# Altium project Autoinformer_v1.1.PrjPcb (part 2 of 2)

## Sheet Sh3_Power.SchDoc
size A3
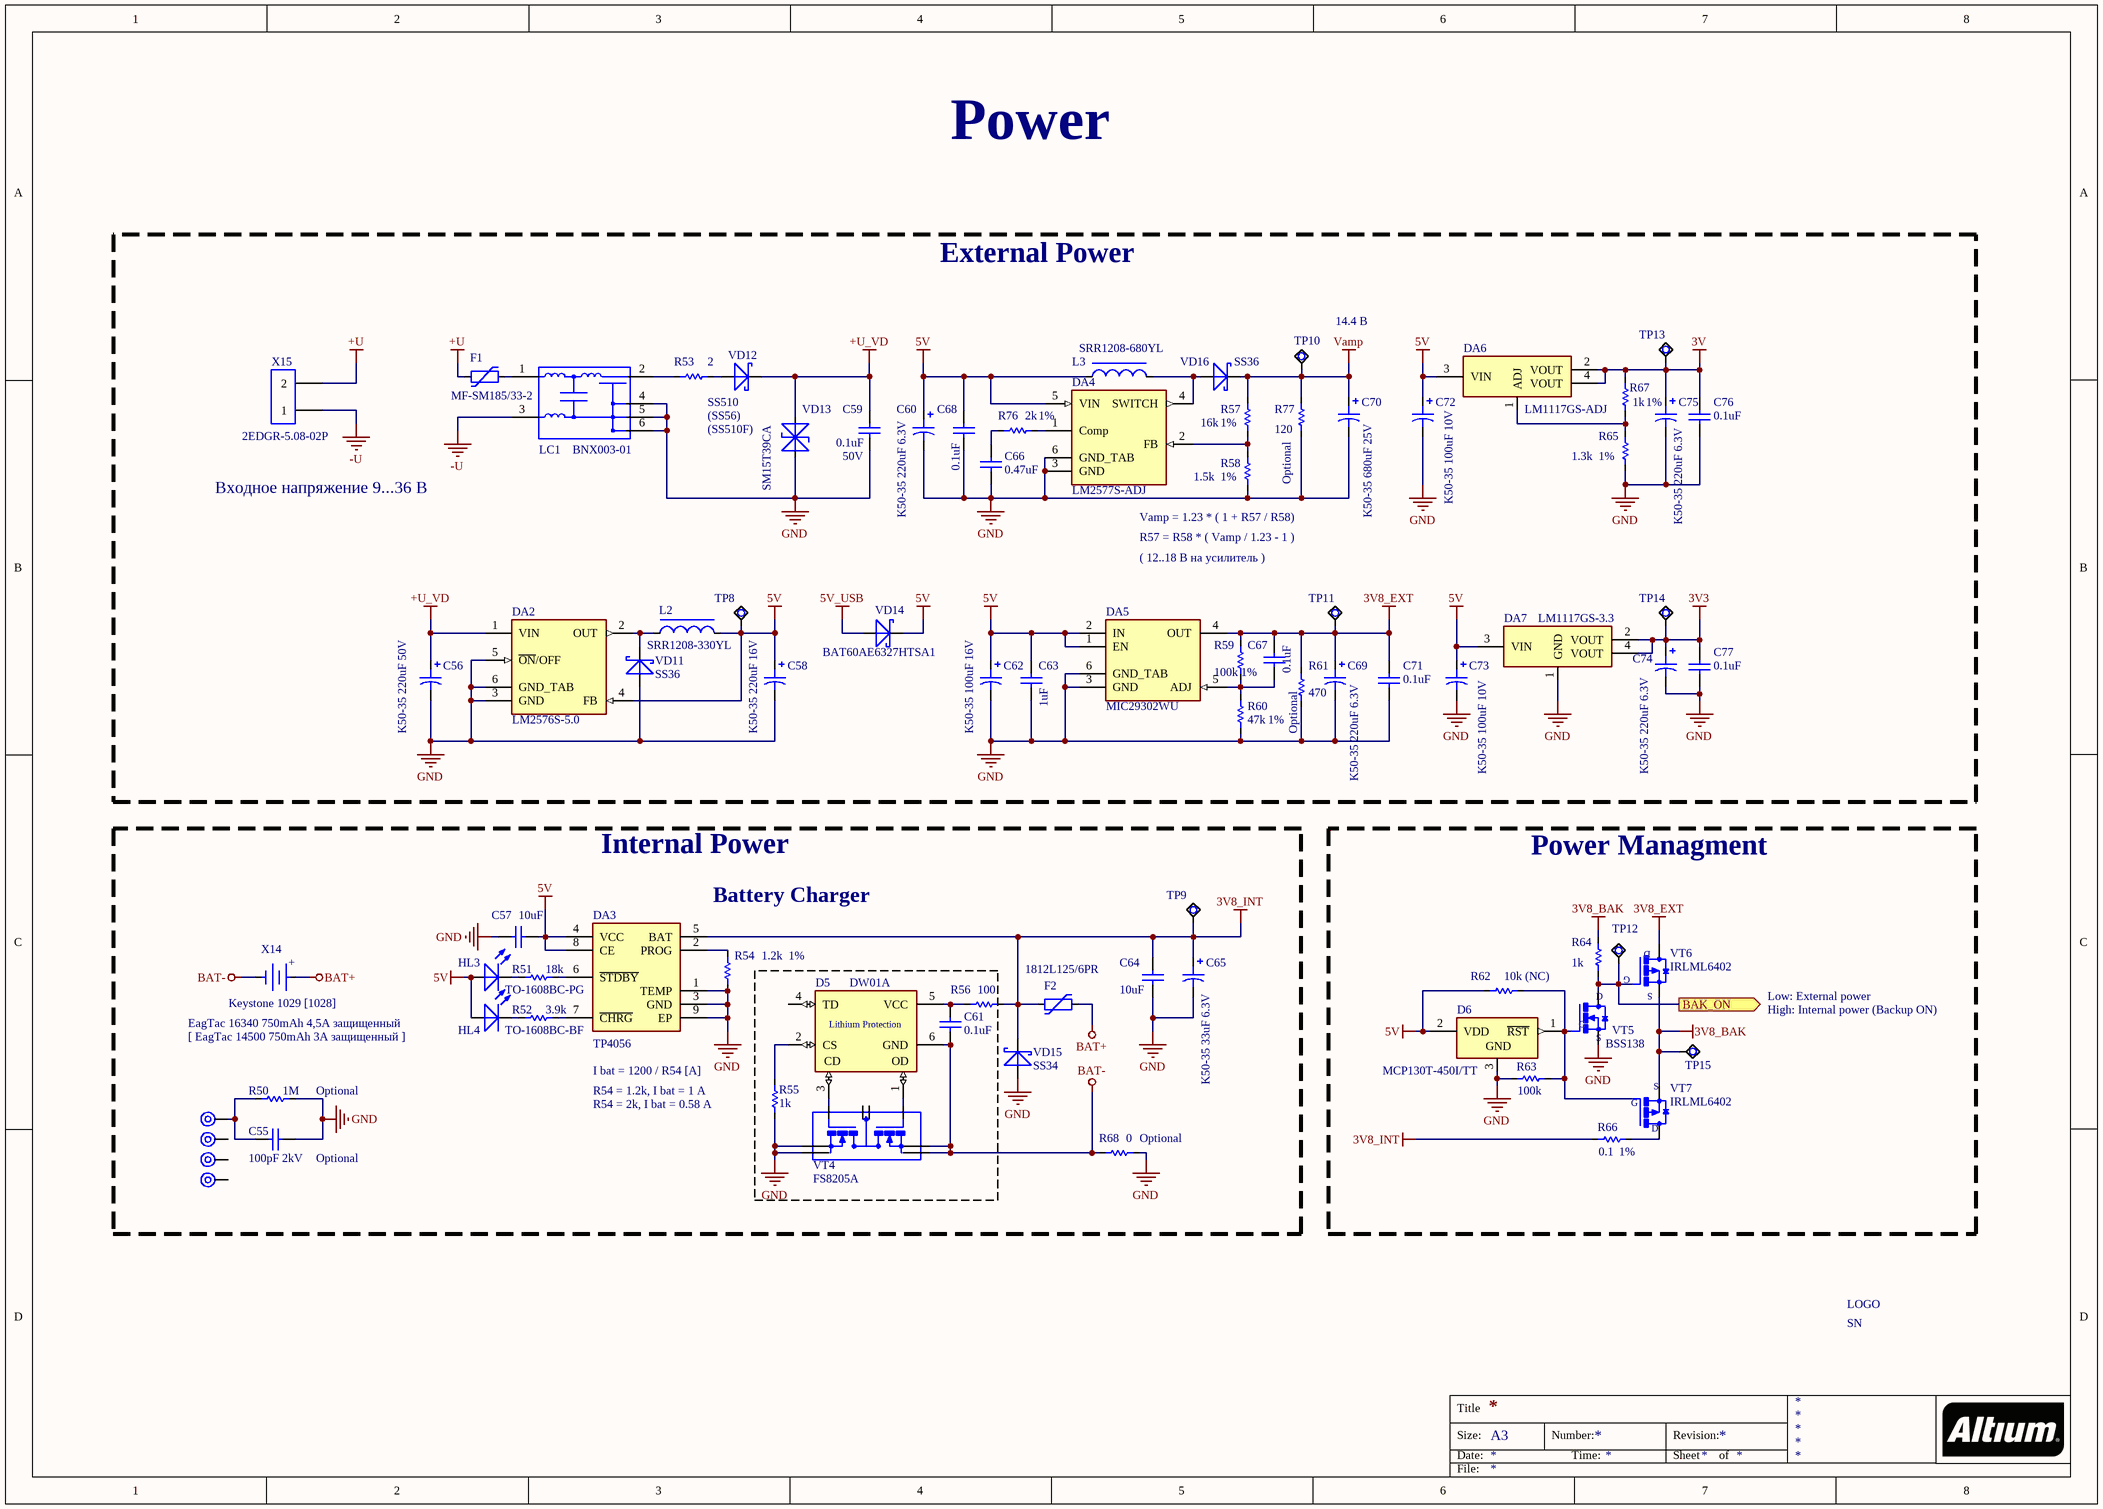
[diagram p3: Sh3_Power.SchDoc]

### Parts
BC1  Mounting Hole  [body_connection_1]  (value not drawn)
BC2  Mounting Hole  [body_connection_1]  (value not drawn)
BC3  Mounting Hole  [body_connection_1]  (value not drawn)
BC4  Mounting Hole  [body_connection_1]  (value not drawn)
C55  100pF 2kV  [C_SMD1206]
C56  K50-35 220uF 50V  [K50-35 10x12.5x5]
C57  10uF  [C_SMD0603]
C58  K50-35 220uF 16V  [K50-35 6.3x11x2.5]
C59  0.1uF  [C_SMD0603]
C60  K50-35 220uF 6.3V  [K50-35 6.3x11x2.5]
C61  0.1uF  [C_SMD0603]
C62  K50-35 100uF 16V  [K50-35 6.3x11x2.5]
C63  1uF  [C_SMD0603]
C64  10uF  [C_SMD0603]
C65  K50-35 33uF 6.3V  [K50-35mini 4x7x2]
C66  0.47uF  [C_SMD0603]
C67  0.1uF  [C_SMD0603]
C68  0.1uF  [C_SMD0603]
C69  K50-35 220uF 6.3V  [K50-35 6.3x11x2.5]
C70  K50-35 680uF 25V  [K50-35 10x12.5x5]
C71  0.1uF  [C_SMD0603]
C72  K50-35 100uF 10V  [K50-35 5x11x2]
C73  K50-35 100uF 10V  [K50-35 5x11x2]
C74  K50-35 220uF 6.3V  [K50-35 6.3x11x2.5]
C75  K50-35 220uF 6.3V  [K50-35 6.3x11x2.5]
C76  0.1uF  [C_SMD0603]
C77  0.1uF  [C_SMD0603]
D5  DW01A  [SOT23-6-D]
D6  MCP130T-450I/TT  [SOT23]
DA2  LM2576S-5.0  [TO263-5 - heatsink]
DA3  TP4056  [SOIC127P600X175-9N]
DA4  LM2577S-ADJ  [TO263-5 - heatsink]
DA5  MIC29302WU  [TO263-5 - heatsink]
DA6  LM1117GS-ADJ  [SOT223]
DA7  LM1117GS-3.3  [SOT223]
F1  MF-SM185/33-2  [FUSM8867X300N]
F2  1812L125/6PR  [FUSSC324X455X62L]
HL3  TO-1608BC-PG  [LED_SMD1608GREEN]
HL4  TO-1608BC-BF  [LED_SMD1608]
L2  SRR1208-330YL  [SRR1208]
L3  SRR1208-680YL  [SRR1208]
LC1  BNX003-01  [Murata_BNX_L12MM5_W11MM5_T13MM0_MFG]
N1  Logo  [LOGO_SS - bot]  (value not drawn)
N2  SN  [KZTA_SN]  (value not drawn)
R50  1M  [R_SMD1206]
R51  18k  [R_SMD0603]
R52  3.9k  [R_SMD0603]
R53  2  [R_SMD4527]
R54  1.2k  [R_SMD0603]
R55  1k  [R_SMD0603]
R56  100  [R_SMD0603]
R57  16k  [R_SMD0603]
R58  1.5k  [R_SMD0603]
R59  100k  [R_SMD0603]
R60  47k  [R_SMD0603]
R61  470  [R_SMD0805]
R62  10k (NC)  [R_SMD0603]
R63  100k  [R_SMD0603]
R64  1k  [R_SMD0603]
R65  1.3k  [R_SMD0603]
R66  0.1  [R_SMD0805]
R67  1k  [R_SMD0603]
R68  0  [R_SMD0805]
R76  2k  [R_SMD0603]
R77  120  [R_SMD0805]
TP8  Test_point  [TEST_POINT]  (value not drawn)
TP9  Test_point  [TEST_POINT]  (value not drawn)
TP10  Test_point  [TEST_POINT]  (value not drawn)
TP11  Test_point  [TEST_POINT]  (value not drawn)
TP12  Test_point  [TEST_POINT]  (value not drawn)
TP13  Test_point  [TEST_POINT]  (value not drawn)
TP14  Test_point  [TEST_POINT]  (value not drawn)
TP15  Test_point  [TEST_POINT]  (value not drawn)
VD11  SS36  [DO214AB SMC]
VD12  SS510  [SMC + SMAF]
VD13  SM15T39CA  [DO214AB SMC]
VD14  BAT60AE6327HTSA1  [SOD-323]
VD15  SS34  [DO214AB SMC]
VD16  SS36  [DO214AB SMC]
VT4  FS8205A  [SOP65P640X120-8N]
VT5  BSS138  [SOT23]
VT6  IRLML6402  [SOT23]
VT7  IRLML6402  [SOT23]
X14  Keystone 1029 [1028]  [BAT_keystone1028+1029]
X15  2EDGR-5.08-02P  [2EDGR-5.08-02P]

### Blocks framed on the sheet
External Power: C56 C58-C60 C62 C63 C66-C77 DA2 DA4-DA7 F1 L2 L3 LC1 R53 R57-R61 R65 R67 R76 R77 TP8 TP10 TP11 TP13 TP14 VD11-VD14 VD16 X15
Internal Power: BC1-BC4 C55 C57 C64 C65 DA3 F2 HL3 HL4 R50-R52 R54 R68 TP9 VD15 X14
Power Managment: D6 R62-R64 R66 TP12 TP15 VT5-VT7
1%: C61 D5 R55 R56 VT4

### Ports
BAK_ON (out)

### Nets
3V: C75.1 C76.1 DA6.2(VOUT) DA6.4(VOUT) R67.2(CW) TP13.1
3V3: C74.1 C77.1 DA7.2(VOUT) DA7.4(VOUT) TP14.1
3V8_BAK: R64.1(CCW) TP15.1 VT6.2(S) VT7.2(S)
3V8_EXT: C67.1 C69.1 C71.1 DA5.4(OUT) R59.2(CW) R61.2(CW) TP11.1 VT6.3(D)
3V8_INT: C64.1 C65.1 DA3.5(BAT) F2.1 R56.1(CCW) R66.2(CW) TP9.1 VD15.2(NEG)
5V: C57.2 C58.1 C60.1 C62.1 C63.1 C68.1 C72.1 C73.1 D6.2(VDD) DA2.4(FB) DA3.4(VCC) DA3.8(CE) DA4.5(VIN) DA5.1(EN) DA5.2(IN) DA6.3(VIN) DA7.3(VIN) HL3.1(POS) HL4.1(POS) L2.2 L3.1 R62.2(CW) TP8.1 VD14.2(NEG)
5V_USB: VD14.1(POS)
+U: F1.1 X15.2
+U_VD: C56.1 C59.1 DA2.1(VIN) VD12.C(NEG) VD13.2(K)
-U: LC1.3(PSG) X15.1
BAT+: F2.2 X14.POS
BAT-: C61.2 D5.6(GND) R68.1(CCW) VT4.2(S1_1) VT4.3(S1_2) X14.NEG
GND: C55.2 C56.2 C57.1 C58.2 C59.2 C60.2 C62.2 C63.2 C64.2 C65.2 C66.2 C68.2 C69.2 C70.2 C71.2 C72.2 C73.2 C74.2 C75.2 C76.2 C77.2 D6.3(VSS) DA2.3(GND) DA2.5(~{ON}/OFF) DA2.6(GND_TAB) DA3.1(TEMP) DA3.3(GND) DA3.9(EP) DA4.3(GND) DA4.6(GND_TAB) DA5.3(GND) DA5.6(GND_TAB) DA7.1(GND) LC1.4(CG) LC1.5(CG) LC1.6(CG) R50.2(CW) R54.1(CCW) R55.2(CW) R58.1(CCW) R60.1(CCW) R61.1(CCW) R63.2(CW) R65.1(CCW) R68.2(CW) R77.1(CCW) VD11.1(POS) VD13.1(A) VD15.1(POS) VT4.6(S2_1) VT4.7(S2_2) VT5.2(S)
Vamp: C70.1 R57.2(CW) R77.2(CW) TP10.1 VD16.2(NEG)
BAK_ON: R64.2(CW) TP12.1 VT5.3(D) VT6.1(G) ; port BAK_ON
NetBC1_1: BC1.1 C55.1 R50.1(CCW)
NetC61_1: C61.1 D5.5(VCC) R56.2(CW)
NetC66_1: C66.1 R76.2(CW)
NetC67_2: C67.2 DA5.5(ADJ) R59.1(CCW) R60.2(CW)
NetD5_1: D5.1(OD) VT4.4(G1)
NetD5_2: D5.2(CS) R55.1(CCW)
NetD5_3: D5.3(OC) VT4.5(G2)
NetD6_1: D6.1(~{RST}) R62.1(CCW) R63.1(CCW) VT5.1(G) VT7.1(G)
NetDA2_2: DA2.2(OUT) L2.1 VD11.2(NEG)
NetDA3_2: DA3.2(PROG) R54.2(CW)
NetDA3_6: DA3.6(~{STDBY}) R51.1(CCW)
NetDA3_7: DA3.7(~{CHRG}) R52.1(CCW)
NetDA4_1: DA4.1(Comp) R76.1(CCW)
NetDA4_2: DA4.2(FB) R57.1(CCW) R58.2(CW)
NetDA4_4: DA4.4(SWITCH) L3.2 VD16.1(POS)
NetDA6_1: DA6.1(ADJ) R65.2(CW) R67.1(CCW)
NetF1_2: F1.2 LC1.1(B)
NetHL3_2: HL3.2(NEG) R51.2(CW)
NetHL4_2: HL4.2(NEG) R52.2(CW)
NetLC1_2: LC1.2(CB) R53.1(CCW)
NetR53_2: R53.2(CW) VD12.A(POS)
NetR66_1: R66.1(CCW) VT7.3(D)

Not connected (* = marked no-connect by the designer): BC2 1; BC3 1; BC4 1; D5 4(TD); VT4 1(D12_1) 8(D12_2)

### Notes on the sheet
- Power
- (near TP10) 14.4 В
- (SS56)
- (SS510F)
- (near R76) 1%
- (near R57) 1%
- (near C75) 1%
- Входное напряжение 9...36 В
- (near C59) 50V
- (near R58) 1%
- (near R77) Optional
- (near R65) 1%
- ( 12..18 В на усилитель )
- Vamp = 1.23 * ( 1 + R57 / R58)
- R57 = R58 * ( Vamp / 1.23 - 1 )
- (near R59) 1%
- 1%
- (near R61) Optional
- Battery Charger
- [ EagTac 14500 750mAh 3А защищенный ]
- (near X14) EagTac 16340 750mAh 4,5А защищенный
- Low: External power
- High: Internal power (Backup ON)
- (near R50) Optional
- I bat = 1200 / R54 [A]
- R54 = 1.2k, I bat = 1 A
- (near R55) R54 = 2k, I bat = 0.58 A
- (near C55) Optional
- (near R68) Optional
- (near R66) 1%
- Title
- Size:
- Date:
- A3
- Number:
- Time:
- Revision:
- Sheet
- of
- File:
- (in symbol Combo Battery Holder) +
- (in symbol DW01A) Lithium Protection; CD
- (in symbol Logo) LOGO
- (in symbol MCP130T-450I/TT) GND
- (in symbol MCP130T-315I/TT) GND

### Library data of the parts
BC1-BC4 = BodyConnector
C55 = C_SMD: C1206C101KGRACAUTO (CC1206JKNPODBN101); ComponentLink1Description: elitan; ComponentLink1URL: https://www.elitan.ru/price/item16896874; ComponentLink2Description: el; ComponentLink2URL: https://www.electronshik.ru/item/KEM/C1206C101KGRACAUTO; ComponentLink3Description: el2; ComponentLink3URL: https://www.electronshik.ru/item/YAG/CC1206JKNPODBN101
C56 = K50-35: SH050M0220B5S-1012 ECAP 10*12 / Конденсатор электролитический алюминиевый; ComponentLink1Description: chipdip; ComponentLink1URL: https://www.chipdip.ru/product0/9000565903; ComponentLink2Description: el; ComponentLink2URL: https://www.electronshik.ru/item/YAG/SH050M0220B5S-1012
C57 C64 = C_SMD: GRM188R61E106M; ComponentLink1Description: chipdip; ComponentLink1URL: https://www.chipdip.ru/product/grm188r61e106m; ComponentLink2Description: el; ComponentLink2URL: https://www.electronshik.ru/item/MUR/GRM188R61E106MA73D
C58 = K50-35: ECA1CM221 6.3x11 P:2,5мм Конденсатор электролитический алюминиевый; ComponentLink1Description: chipdip; ComponentLink1URL: https://www.chipdip.ru/product0/9000565899; ComponentLink2Description: el; ComponentLink2URL: https://www.electronshik.ru/item/PAN/ECA1CM221
C59 C61 C67 C68 C71 C76 C77 = C_SMD: GRM188R71H104KA93D; ComponentLink1Description: chipdip; ComponentLink1URL: https://www.chipdip.ru/product0/226236018; ComponentLink2Description: el; ComponentLink2URL: https://www.electronshik.ru/item/MUR/GRM188R71H104KA93D
C60 C69 C74 C75 = K50-35: ECA0JHG221 5x11мм Р:2,5мм Конденсатор электролитический алюминиевый; ComponentLink1URL: https://www.chipdip.ru/product0/9000261774?from=suggest_product; ComponentLink2Description: el; ComponentLink2URL: https://www.electronshik.ru/item/PAN/ECA0JHG221
  C60: ComponentLink1Description: chipdip
  C69 C74 C75: ComponentLink1Description: (К50-35 мини), 220 мкФ, 6.3 В, 6.3х7мм
C62 = K50-35: SH016M0100A2F-0511 5x11мм Конденсатор электролитический алюминиевый; ComponentLink1Description: chipdip; ComponentLink1URL: https://www.chipdip.ru/product0/9000565888; ComponentLink2Description: el; ComponentLink2URL: https://www.electronshik.ru/item/YAG/SH016M0100A2F-0511
C63 = C_SMD: GRM188R71E105KA12D; ComponentLink1Description: chipdip; ComponentLink1URL: https://www.chipdip.ru/product/grm188r71e105ka12d; ComponentLink2Description: el; ComponentLink2URL: https://www.electronshik.ru/item/MUR/GRM188R71E105KA12D
C65 = K50-35: Конденсатор электролитический алюминиевый 33 мкФ, 6.3 В, 4х7мм; ComponentLink1Description: (К50-35 мини), 33 мкФ, 6.3 В, 4х7мм; ComponentLink1URL: https://www.chipdip.ru/product0/9000261769
C66 = C_SMD: C1608X7R1H474K080AC; ComponentLink1Description: chipdip; ComponentLink1URL: https://www.chipdip.ru/product0/8576565346; ComponentLink2Description: el; ComponentLink2URL: https://www.electronshik.ru/item/TDK/C1608X7R1H474K080AC
C70 = K50-35: Конденсатор электролитический алюминиевый 680мкФ, 25В, 10х16мм Р:5мм; ComponentLink1Description: chipdip; ComponentLink1URL: https://www.chipdip.ru/product0/9000565919
C72 C73 = K50-35: Конденсатор электролитический алюминиевый; ComponentLink1Description: chipdip-mini; ComponentLink1URL: https://www.chipdip.ru/product0/46079?from=suggest_product; ComponentLink2Description: chipdip; ComponentLink2URL: https://www.chipdip.ru/product0/9000565886
D5 = DW01A: Pushbutton Switch SPST-NC Standard Panel Mount, Front; MF: Fortune Semiconductor; Price: None; Availability: Unavailable; Package: Package Analog Devices; SnapEDA_Link: https://www.snapeda.com/parts/DW01A/Fortune%20Semiconductor/view-part/4388554/?ref=snap; MP: DW01A; Value: *; ComponentLink1Description: elitan; ComponentLink1URL: https://www.elitan.ru/price/item379006536; ComponentLink2Description: electronshik; ComponentLink2URL: https://www.electronshik.ru/item/FUMAN/DW01A
D6 = MCP130T-450I/TT: 4.50 V 150 ms Microcontroller Supervisory Circuit - SOT-23-3; MP: MCP130T-315I/TT; MF: Microchip; Value: *; Availability: Unavailable; Price: None; Package: SOT-23 Microchip; SnapEDA_Link: https://www.snapeda.com/parts/MCP130T-315I/TT/Microchip/view-part/12206/?ref=snap; ComponentLink1Description: elitan; ComponentLink1URL: https://www.elitan.ru/price/item505438; ComponentLink2Description: electronshik; ComponentLink2URL: https://www.electronshik.ru/item/MCRCH/MCP130T-450I%3A%3ATT
DA2 = LM2576S: Импульсный понижающий регулятор напряжения, 5В, 3А, [TO-263]; ComponentLink1Description: 5V-chipdip; ComponentLink1URL: https://www.chipdip.ru/product/lm2576sx-5.0-nopb; ComponentLink2Description: 5V-elitan; ComponentLink2URL: https://www.elitan.ru/price/item100181
DA3 = TP4056: Li-lon Battery Charger  1A Standalone Linear with Thermal Regulation in SOP-8; Manufacturer_Name: NanJing Top Power; Datasheet Link: https://dlnmh9ip6v2uc.cloudfront.net/datasheets/Prototyping/TP4056.pdf; Height: 1.75mm; Manufacturer_Part_Number: TP4056; ComponentLink1Description: elitan; ComponentLink1URL: https://www.elitan.ru/price/item26170288; ComponentLink2Description: electonshik; ComponentLink2URL: https://www.electronshik.ru/item/YOUTAI/TP4056
DA4 = LM2577S-ADJ: Преобразователь постоянного тока повышающий 3 А вход 3.5...40В выход 5...60В -40...+125°С; ComponentLink1Description: elitan; ComponentLink1URL: https://www.elitan.ru/price/item100192
DA5 = MIC29302WU: 3A Fast Response LDO Regulator / Operating Input Voltage Range: 3V to 16V / 1.24V to 15V Adjustable Output Voltage; ComponentLink1Description: elitan; ComponentLink1URL: https://www.elitan.ru/price/item637427; ComponentLink2Description: chipdip; ComponentLink2URL: https://www.chipdip.ru/product0/8000649332; ComponentLink3Description: electronshik; ComponentLink3URL: https://www.electronshik.ru/item/MCRCH/MIC29302WU
DA6 = LM1117GS-ADJ: LDO +1.25...13.8 В, 1А [SOT-223] / Линейный регулятор с низким падением напряжения, Максимальное входное напряжение, 20 В; ComponentLink1Description: chipdip; ComponentLink1URL: https://www.chipdip.ru/product/lm1117gs-adj; ComponentLink2Description: elitan; ComponentLink2URL: https://www.elitan.ru/price/item21580115
DA7 = LM1117GS-3.3: LDO +3.3 В, 1А [SOT-223] / Линейный регулятор с низким падением напряжения, Максимальное входное напряжение, 20 В; ComponentLink1Description: chipdip; ComponentLink1URL: https://www.chipdip.ru/product/lm1117gs-3.3; ComponentLink2Description: elitan; ComponentLink2URL: https://www.elitan.ru/price/item21580113
F1 = MF-SM185/33-2: Самовосстанавливающийся предохранитель PTC 1.8A(hold) 3.6A(trip) 33VDC 40A 1.9W 5s 0.04Ohm SMD 3425 Solder Pad 9.5 X 6.71 X 3mm; ComponentLink1Description: elitan; ComponentLink1URL: https://www.elitan.ru/price/item781521; ComponentLink2Description: chipdip; ComponentLink2URL: https://www.chipdip.ru/product0/8001787493?from=suggest_product
F2 = 1812L125/6PR: Предохранитель SMD 6 VDC 2.5 A; ComponentLink1Description: elitan; ComponentLink1URL: https://www.elitan.ru/price/item387111
HL3 = LED_SMD: Vf =3.3V, 20mA, 0603 (HL-PST-1608U51GC); ComponentLink1Description: chipdip-green-smd; ComponentLink1URL: https://www.chipdip.ru/product/to-1608bc-pg?from=suggest_product; ComponentLink2Description: elitan-green-smd; ComponentLink2URL: https://www.elitan.ru/price/item16986058; ComponentLink3Description: el; ComponentLink3URL: https://www.electronshik.ru/item/HONGLI/HL-PST-1608U51GC
HL4 = LED_SMD: Vf =3.3V, 20mA, 0603 (HL-PST-1608H203BC); ComponentLink1Description: chipdip-blue-smd; ComponentLink1URL: https://www.chipdip.ru/product/to-1608bc-bf?from=suggest_product; ComponentLink2Description: elitan-blue-smd; ComponentLink2URL: https://www.elitan.ru/price/item16986057; ComponentLink3Description: el; ComponentLink3URL: https://www.electronshik.ru/item/HONGLI/HL-PST-1608H203BC
L2 L3 = SRR1208-330YL: SMD индуктивность проволочная, на ферритовом сердечнике, экранированная 33uH 15% 1KHz 23Q-Factor Ferrite 2.8A 62mOhm; ComponentLink1Description: chipdip; ComponentLink2Description: elitan
  L2: ComponentLink1URL: https://www.chipdip.ru/product/srr1208-330yl?from=suggest_product; ComponentLink2URL: https://www.elitan.ru/price/item319349
  L3: ComponentLink1URL: https://www.chipdip.ru/product1/8002012849?from=suggest_product; ComponentLink2URL: https://www.elitan.ru/price/item782382
LC1 = BNX003-01: EMI фильтр индуктивно-емкостной 10A 150VDC 40дБ; ComponentLink1Description: elitan; ComponentLink1URL: https://www.elitan.ru/price/item279156; ComponentLink2Description: chipdip; ComponentLink2URL: https://www.chipdip.ru/product/bnx003-01?from=suggest_product
N1 = Logo: Print on PCB mask
N2 = SerialNumber: Board Serial Number Placement
R50 = R_SMD: RC1206JR-071ML; ComponentLink1Description: chipdip; ComponentLink1URL: https://www.chipdip.ru/product0/690816980; ComponentLink2Description: el; ComponentLink2URL: https://www.electronshik.ru/item/YAG/RC1206JR-071ML
R51 = R_SMD: RC0603FR-0718KL; ComponentLink1Description: chipdip; ComponentLink1URL: https://www.chipdip.ru/product0/9000079742; ComponentLink2Description: el; ComponentLink2URL: https://www.electronshik.ru/item/YAG/RC0603FR-0718KL
R52 = R_SMD: RC0603FR-073K9L; ComponentLink1Description: chipdip; ComponentLink1URL: https://www.chipdip.ru/product0/9000079726?from=suggest_product; ComponentLink2Description: el; ComponentLink2URL: https://www.electronshik.ru/item/YAG/RC0603FR-073K9L
R53 = WSC45272R000FEA: WSC45272R000FEA SMD чип резистор, с проволочной обмоткой, 4527, 2 Ом, Серия WSC, 2 Вт; ComponentLink1Description: chipdip; ComponentLink1URL: https://www.chipdip.ru/product/wsc45272r000fea?from=suggest_product; ComponentLink2Description: elitan; ComponentLink2URL: https://www.elitan.ru/price/item572273
R54 = R_SMD: RC0603FR-071K2L; ComponentLink1Description: chipdip; ComponentLink1URL: https://www.chipdip.ru/product0/9000079678; ComponentLink2Description: el; ComponentLink2URL: https://www.electronshik.ru/item/YAG/RC0603FR-071K2L
R55 R64 R67 = R_SMD: RC0603FR-071KL; ComponentLink1Description: chipdip; ComponentLink1URL: https://www.chipdip.ru/product0/9000079676; ComponentLink2Description: el; ComponentLink2URL: https://www.electronshik.ru/item/YAG/RC0603FR-071KL
R56 = R_SMD: RC0603FR-07100RL; ComponentLink1Description: chipdip; ComponentLink1URL: https://www.chipdip.ru/product0/9000079616; ComponentLink2Description: el; ComponentLink2URL: https://www.electronshik.ru/item/YAG/RC0603FR-07100RL
R57 = R_SMD: RC0603FR-0716KL; ComponentLink1Description: chipdip; ComponentLink1URL: https://www.chipdip.ru/product0/9000079741; ComponentLink2Description: el; ComponentLink2URL: https://www.electronshik.ru/item/YAG/RC0603FR-0716KL
R58 = R_SMD: RC0603FR-071K5L; ComponentLink1Description: chipdip; ComponentLink1URL: https://www.chipdip.ru/product0/9000079716?from=suggest_product; ComponentLink2Description: el; ComponentLink2URL: https://www.electronshik.ru/item/YAG/RC0603FR-071K5L
R59 R63 = R_SMD: RC0603FR-07100KL; ComponentLink1Description: chipdip; ComponentLink1URL: https://www.chipdip.ru/product0/9000079760; ComponentLink2Description: el; ComponentLink2URL: https://www.electronshik.ru/item/YAG/RC0603FR-07100KL
R60 = R_SMD: RC0603FR-0747KL; ComponentLink1Description: chipdip; ComponentLink1URL: https://www.chipdip.ru/product0/9000079752; ComponentLink2Description: el; ComponentLink2URL: https://www.electronshik.ru/item/YAG/RC0603FR-0747KL
R61 = R_SMD: RC0805FR-07470RL; ComponentLink1Description: chipdip; ComponentLink1URL: https://www.chipdip.ru/product0/9000079478; ComponentLink2Description: el; ComponentLink2URL: https://www.electronshik.ru/item/YAG/RC0805FR-07470RL
R62 = R_SMD: RC0603FR-0710KL (CRCW060310K0FKEA); ComponentLink1Description: el; ComponentLink1URL: https://www.electronshik.ru/item/VISHAY/CRCW060310K0FKEA
R65 = R_SMD: RC0603FR-071K3L; ComponentLink1Description: chipdip; ComponentLink1URL: https://www.chipdip.ru/product0/9000079679; ComponentLink2Description: el; ComponentLink2URL: https://www.electronshik.ru/item/YAG/RC0603FR-071K3L
R66 = R_SMD: RL0805FR-070R1L; ComponentLink1Description: elitan; ComponentLink1URL: https://www.elitan.ru/price/item503786; ComponentLink2Description: el; ComponentLink2URL: https://www.electronshik.ru/item/YAG/RL0805FR-070R1L
R68 = R_SMD: RC0805JR-070RL; ComponentLink1Description: chipdip; ComponentLink1URL: https://www.chipdip.ru/product0/153356071; ComponentLink2Description: el; ComponentLink2URL: https://www.electronshik.ru/item/YAG/RC0805JR-070RL
R76 = R_SMD: RC0603FR-072KL; ComponentLink1Description: chipdip; ComponentLink1URL: https://www.chipdip.ru/product0/9000079719; ComponentLink2Description: el; ComponentLink2URL: https://www.electronshik.ru/item/YAG/RC0603FR-072KL
R77 = R_SMD: RC0805FR-07120RL; ComponentLink1Description: chipdip; ComponentLink1URL: https://www.chipdip.ru/product0/9000079464; ComponentLink2Description: el; ComponentLink2URL: https://www.electronshik.ru/item/YAG/RC0805FR-07120RL
TP8-TP15 = Test_point: Test point for PCB
VD11 VD16 = SS36: Schottky; DO-214AB; 3.0A IF; 0.75V; 60V; 100A IFRM; 10000V/us; 1000pF; ComponentLink1Description: elitan; ComponentLink1URL: https://www.elitan.ru/price/item499214; ComponentLink2Description: chipdip; ComponentLink2URL: https://www.chipdip.ru/product/ss36-e3-57t-2?from=suggest_product
VD12 = SS510: Диод Шоттки 5A 100V (SMC); ComponentLink1Description: chipdip; ComponentLink1URL: https://www.chipdip.ru/product0/8002382677?from=suggest_product; ComponentLink2Description: elitan; ComponentLink2URL: https://www.elitan.ru/price/item24826922
VD13 = SM15T39CA: TVS Diode Bi-Directional SM15T39CA 69.7V, 1500W, SMC 2-Pin; ComponentLink1Description: chipdip; ComponentLink1URL: https://www.chipdip.ru/product/sm15t39ca?from=suggest_product; ComponentLink2Description: elitan; ComponentLink2URL: https://www.elitan.ru/price/item636974
VD14 = BAT60AE6327HTSA1: Диод Шоттки 3А 10В [SOD-323]; ComponentLink1Description: chipdip; ComponentLink1URL: https://www.chipdip.ru/product/bat60a?from=suggest_product; ComponentLink2Description: elitan; ComponentLink2URL: https://www.elitan.ru/price/item9533309
VD15 = SS34: Schottky; DO-214AB; 3.0A IF; 0.75V; 40V; 100A IFRM; 10000V/us; 1000pF; ComponentLink1Description: chipdip; ComponentLink1URL: https://www.chipdip.ru/product/ss34-5; ComponentLink2Description: elitan; ComponentLink2URL: https://www.elitan.ru/price/item9505516
VT4 = FS8205A: 20V 6A DUAL N-Channel MOSFET Transistor; Manufacturer_Name: SII Semiconductor; Datasheet Link: http://www.ic-fortune.com/upload/Download/FS8205A-DS-12_EN.pdf; Height: 1.2mm; Manufacturer_Part_Number: FS8205A; ComponentLink1Description: elitan; ComponentLink1URL: https://www.elitan.ru/price/item13487239; ComponentLink2Description: electronshik; ComponentLink2URL: https://www.electronshik.ru/item/FUXIN/FS8205A
VT5 = BSS138: MOSFET, N-канал, 0.2А, 50В, [SOT-23]; ComponentLink1Description: chipdip; ComponentLink1URL: https://www.chipdip.ru/product/bss138-7-f-diodes?from=suggest_product; ComponentLink2Description: elitan; ComponentLink2URL: https://www.elitan.ru/price/item305174
VT6 VT7 = IRLML6402: P-Channel 20V 3.7A _Ta_ 1.3W _Ta_ Surface Mount/SOT-23; MF: Infineon Technologies; Package: SC-59 Infineon Technologies; Value: *; Availability: Unavailable; SnapEDA_Link: https://www.snapeda.com/parts/IRLML6402/Infineon%20Technologies/view-part/2522811/?ref=snap; Price: None; MP: IRLML6402; ComponentLink1Description: chipdip; ComponentLink1URL: https://www.chipdip.ru/product/irlml6402tr?from=suggest_product; ComponentLink2Description: elitan; ComponentLink2URL: https://www.elitan.ru/price/item13518502
X14 = Combo Battery Holder: 16340 2/3A [14500 AA] Battery Holder; ComponentLink1Description: keystone1029-elitan; ComponentLink1URL: https://www.elitan.ru/price/item468733; ComponentLink2Description: keystone1028-elitan; ComponentLink2URL: https://www.elitan.ru/price/item535632; ComponentLink3Description: batteryholders; ComponentLink3URL: https://www.batteryholders.com/search.php?cat=Battery+Holder&num=&type=CR123A&term=&override=16340
X15 = 2EDGR-5.08-02P: Клеммник разъемный угловой 2 конт., шаг 5.08 мм / (KLS2-EDR-5.08-02P-4) / 2EDGK-5.08-02P - ответная часть; ComponentLink1Description: chipdip; ComponentLink1URL: https://www.chipdip.ru/product/kls2-edr-5.08-02p-4-2edgr-5.08-02p; ComponentLink2Description: elitan; ComponentLink2URL: https://www.elitan.ru/price/item21239767; ComponentLink3Description: ответная-часть; ComponentLink3URL: https://www.elitan.ru/price/item130957; ComponentLink4Description: на-кабель; ComponentLink4URL: https://www.chipdip.ru/product/kls2-edk-5.08-02p-4s-2esdv-02p?from=suggest_product

## Nets that join several sheets
1V8: Sh1_MPU (14 pins), Sh2_MCU (C45.1 D4.1 D4.8)
3V: Sh1_MPU (C1.2 C2.2 X2.4), Sh3_Power (6 pins)
3V3: Sh1_MPU (9 pins), Sh2_MCU (16 pins), Sh3_Power (5 pins)
3V8_BAK: Sh1_MPU (IND6.2 VD7.C), Sh3_Power (R64.1 TP15.1 VT6.2 VT7.2)
3V8_EXT: Sh1_MPU (HL1.1 HL2.1), Sh3_Power (8 pins)
5V: Sh1_MPU (IND9.1 R29.1 R39.2 R75.2), Sh3_Power (24 pins)
5V_USB: Sh1_MPU (D1.11 VD3.2 X3.1), Sh3_Power (VD14.1)
GND: Sh1_MPU (81 pins), Sh2_MCU (19 pins), Sh3_Power (52 pins)
Vamp: Sh1_MPU (IND8.1), Sh3_Power (5 pins)
BAK_ON: Sh1_MPU (R33.2), Sh3_Power (R64.2 TP12.1 VT5.3 VT6.1)
GPIO41: Sh1_MPU (D1.52 R36.1), Sh2_MCU (D4.2)
GPIO77: Sh1_MPU (D1.87), Sh2_MCU (D4.3)
PA4: Sh1_MPU (R12.1), Sh2_MCU (DD1.14 X12.8)
PB0: Sh1_MPU (R10.1), Sh2_MCU (DD1.18 X12.12)
PB2: Sh1_MPU (R8.1), Sh2_MCU (DD1.20 X12.14)
UART_RX: Sh1_MPU (D1.68), Sh2_MCU (D4.4)
UART_TX: Sh1_MPU (D1.71), Sh2_MCU (D4.5)